# EAGLE schematic Clock (EAGLE 9.0.1)
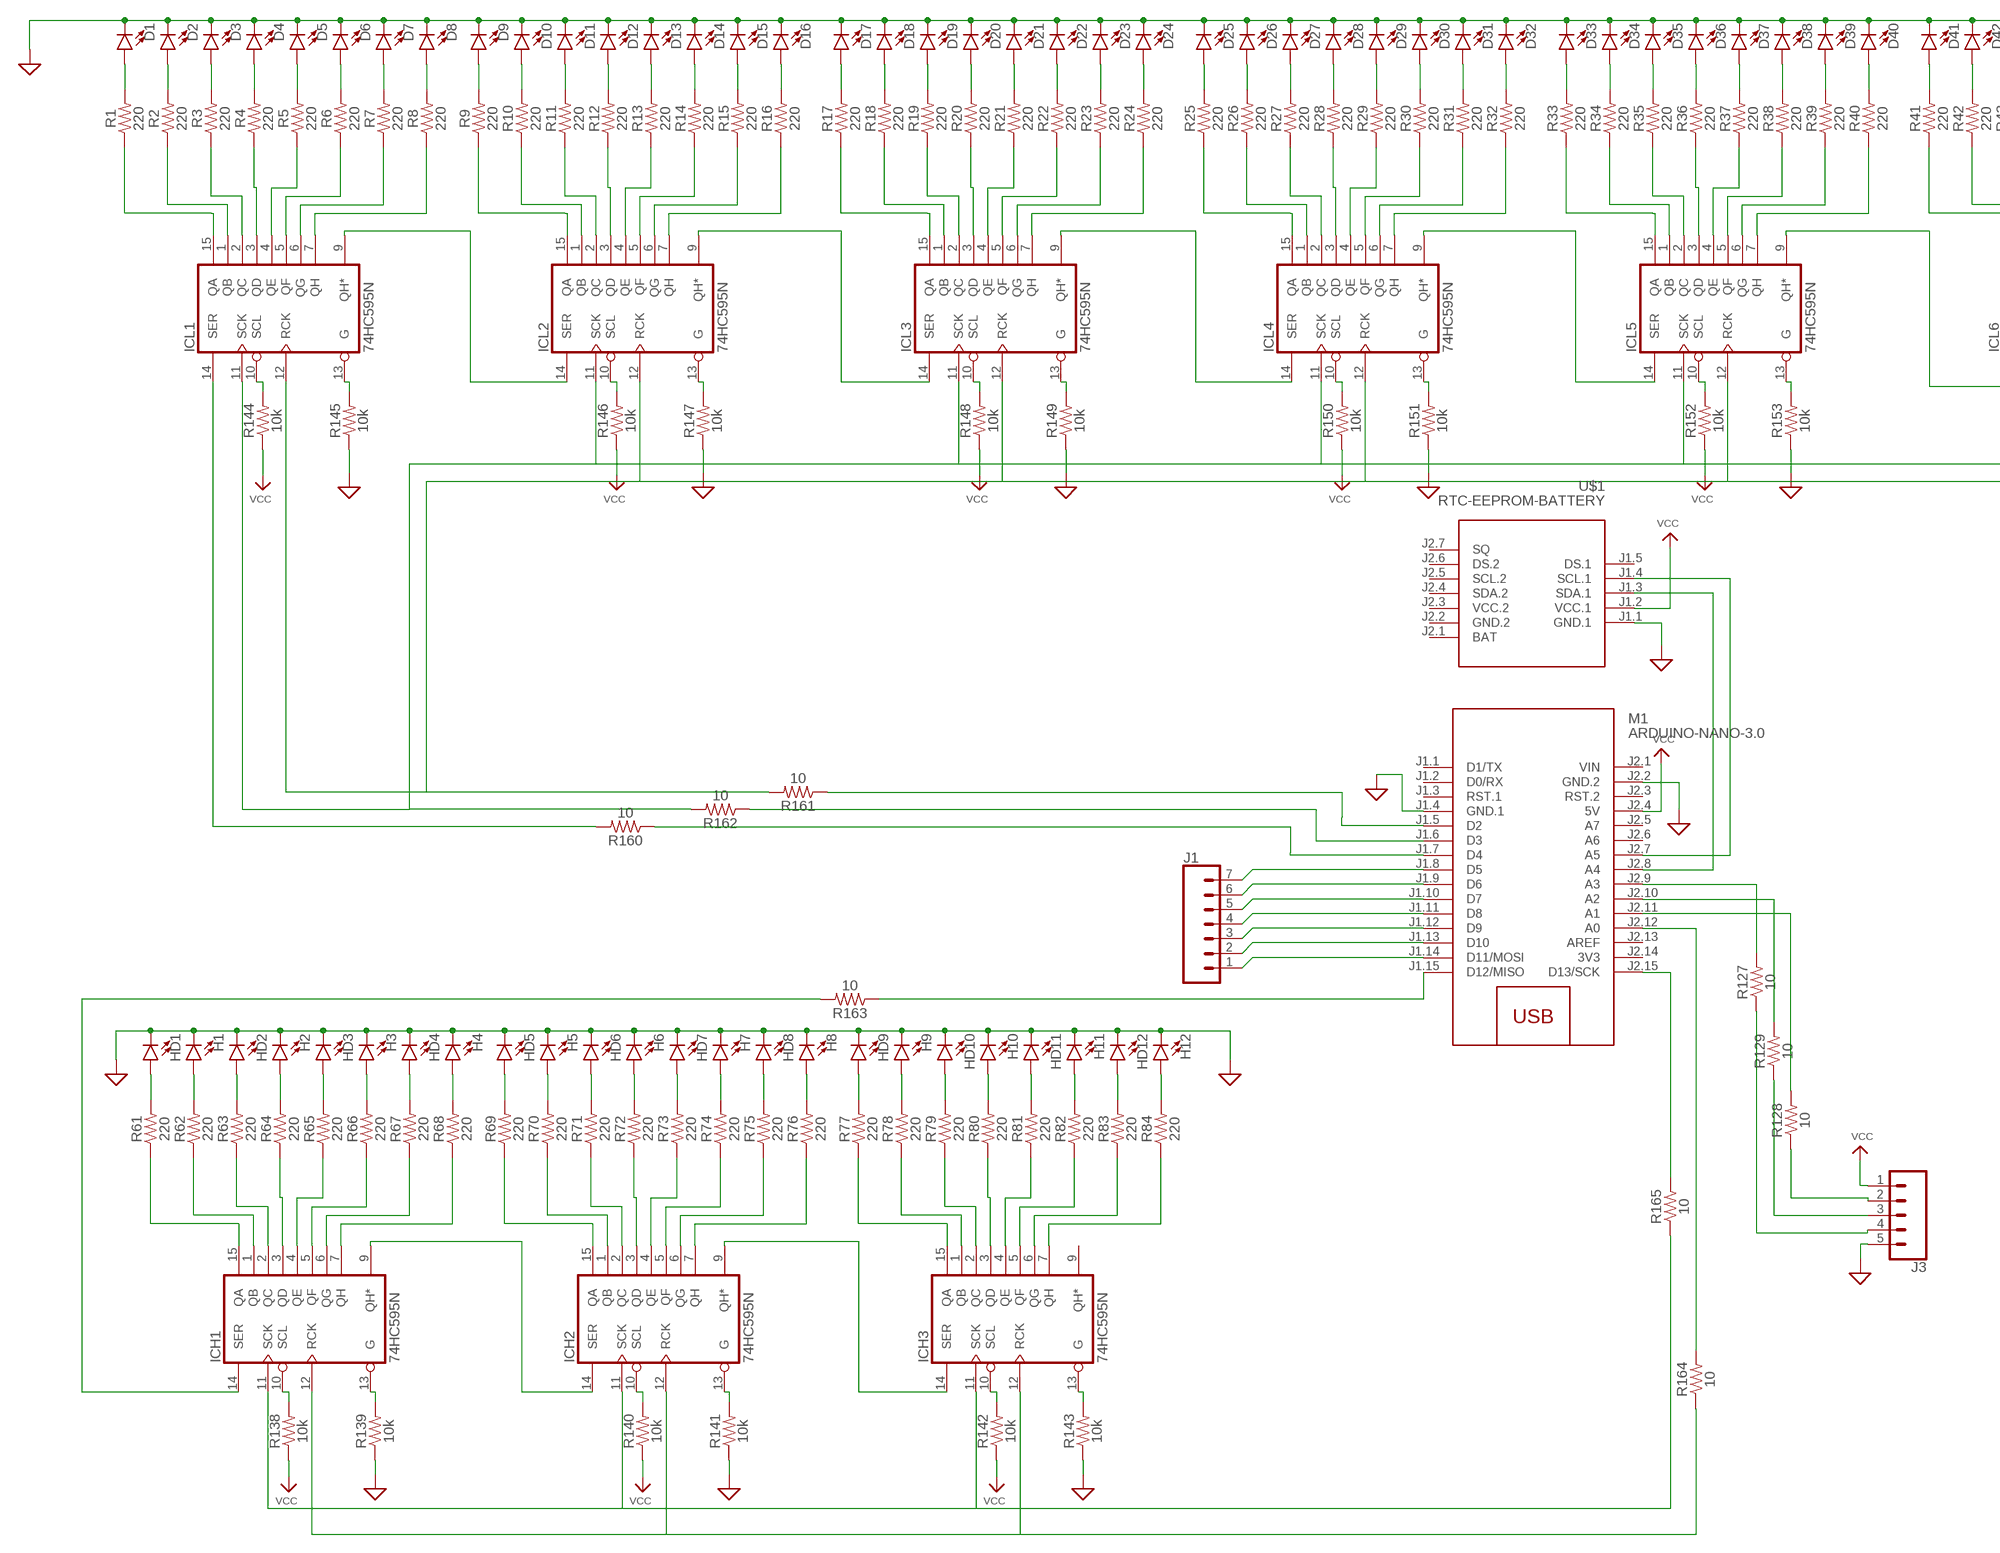
[diagram p0: schematic, sheet 1, part 1 of 2]
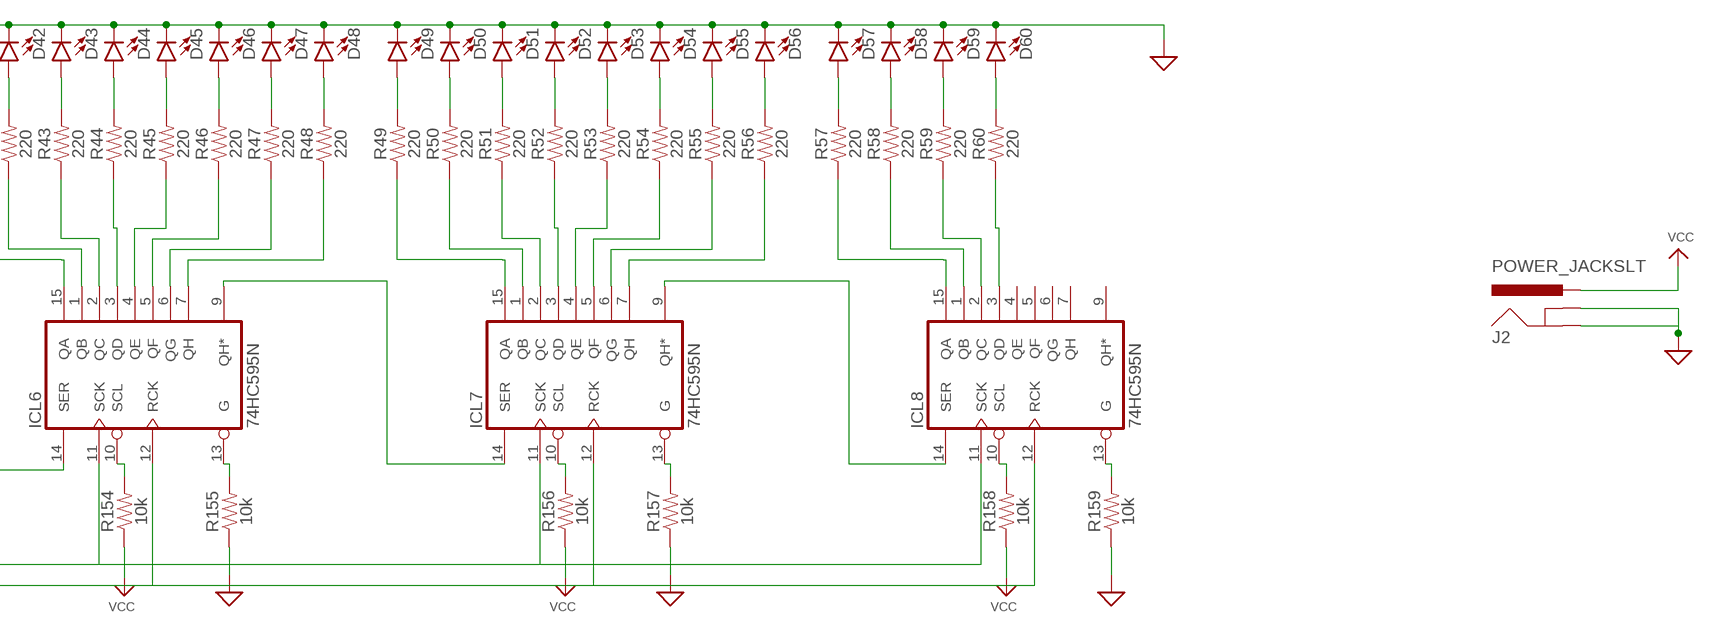
[diagram p1: schematic, sheet 1, part 2 of 2]

## Parts
D1  LED5MM  [LED_5MM]
D2  LED5MM  [LED_5MM]
D3  LED5MM  [LED_5MM]
D4  LED5MM  [LED_5MM]
D5  LED5MM  [LED_5MM]
D6  LED5MM  [LED_5MM]
D7  LED5MM  [LED_5MM]
D8  LED5MM  [LED_5MM]
D9  LED5MM  [LED_5MM]
D10  LED5MM  [LED_5MM]
D11  LED5MM  [LED_5MM]
D12  LED5MM  [LED_5MM]
D13  LED5MM  [LED_5MM]
D14  LED5MM  [LED_5MM]
D15  LED5MM  [LED_5MM]
D16  LED5MM  [LED_5MM]
D17  LED5MM  [LED_5MM]
D18  LED5MM  [LED_5MM]
D19  LED5MM  [LED_5MM]
D20  LED5MM  [LED_5MM]
D21  LED5MM  [LED_5MM]
D22  LED5MM  [LED_5MM]
D23  LED5MM  [LED_5MM]
D24  LED5MM  [LED_5MM]
D25  LED5MM  [LED_5MM]
D26  LED5MM  [LED_5MM]
D27  LED5MM  [LED_5MM]
D28  LED5MM  [LED_5MM]
D29  LED5MM  [LED_5MM]
D30  LED5MM  [LED_5MM]
D31  LED5MM  [LED_5MM]
D32  LED5MM  [LED_5MM]
D33  LED5MM  [LED_5MM]
D34  LED5MM  [LED_5MM]
D35  LED5MM  [LED_5MM]
D36  LED5MM  [LED_5MM]
D37  LED5MM  [LED_5MM]
D38  LED5MM  [LED_5MM]
D39  LED5MM  [LED_5MM]
D40  LED5MM  [LED_5MM]
D41  LED5MM  [LED_5MM]
D42  LED5MM  [LED_5MM]
D43  LED5MM  [LED_5MM]
D44  LED5MM  [LED_5MM]
D45  LED5MM  [LED_5MM]
D46  LED5MM  [LED_5MM]
D47  LED5MM  [LED_5MM]
D48  LED5MM  [LED_5MM]
D49  LED5MM  [LED_5MM]
D50  LED5MM  [LED_5MM]
D51  LED5MM  [LED_5MM]
D52  LED5MM  [LED_5MM]
D53  LED5MM  [LED_5MM]
D54  LED5MM  [LED_5MM]
D55  LED5MM  [LED_5MM]
D56  LED5MM  [LED_5MM]
D57  LED5MM  [LED_5MM]
D58  LED5MM  [LED_5MM]
D59  LED5MM  [LED_5MM]
D60  LED5MM  [LED_5MM]
H1  LED5MM  [LED_5MM]
H2  LED5MM  [LED_5MM]
H3  LED5MM  [LED_5MM]
H4  LED5MM  [LED_5MM]
H5  LED5MM  [LED_5MM]
H6  LED5MM  [LED_5MM]
H7  LED5MM  [LED_5MM]
H8  LED5MM  [LED_5MM]
H9  LED5MM  [LED_5MM]
H10  LED5MM  [LED_5MM]
H11  LED5MM  [LED_5MM]
H12  LED5MM  [LED_5MM]
HD1  LED5MM  [LED_5MM]
HD2  LED5MM  [LED_5MM]
HD3  LED5MM  [LED_5MM]
HD4  LED5MM  [LED_5MM]
HD5  LED5MM  [LED_5MM]
HD6  LED5MM  [LED_5MM]
HD7  LED5MM  [LED_5MM]
HD8  LED5MM  [LED_5MM]
HD9  LED5MM  [LED_5MM]
HD10  LED5MM  [LED_5MM]
HD11  LED5MM  [LED_5MM]
HD12  LED5MM  [LED_5MM]
ICH1  74HC595N  [DIL16]
ICH2  74HC595N  [DIL16]
ICH3  74HC595N  [DIL16]
ICL1  74HC595N  [DIL16]
ICL2  74HC595N  [DIL16]
ICL3  74HC595N  [DIL16]
ICL4  74HC595N  [DIL16]
ICL5  74HC595N  [DIL16]
ICL6  74HC595N  [DIL16]
ICL7  74HC595N  [DIL16]
ICL8  74HC595N  [DIL16]
J1  CONN_07LOCK_LONGPADS  [1X07_LOCK_LONGPADS]
J2  POWER_JACKSLT  [POWER_JACK_SLOT]
J3  CONN_05LOCK_LONGPADS  [1X05_LOCK_LONGPADS]
M1  ARDUINO-NANO-3.0  [ARDUINO-NANO-3.0]
R1  220  1KOHM-HORIZ-1/4W-1%  [AXIAL-0.3]
R2  220  1KOHM-HORIZ-1/4W-1%  [AXIAL-0.3]
R3  220  1KOHM-HORIZ-1/4W-1%  [AXIAL-0.3]
R4  220  1KOHM-HORIZ-1/4W-1%  [AXIAL-0.3]
R5  220  1KOHM-HORIZ-1/4W-1%  [AXIAL-0.3]
R6  220  1KOHM-HORIZ-1/4W-1%  [AXIAL-0.3]
R7  220  1KOHM-HORIZ-1/4W-1%  [AXIAL-0.3]
R8  220  1KOHM-HORIZ-1/4W-1%  [AXIAL-0.3]
R9  220  1KOHM-HORIZ-1/4W-1%  [AXIAL-0.3]
R10  220  1KOHM-HORIZ-1/4W-1%  [AXIAL-0.3]
R11  220  1KOHM-HORIZ-1/4W-1%  [AXIAL-0.3]
R12  220  1KOHM-HORIZ-1/4W-1%  [AXIAL-0.3]
R13  220  1KOHM-HORIZ-1/4W-1%  [AXIAL-0.3]
R14  220  1KOHM-HORIZ-1/4W-1%  [AXIAL-0.3]
R15  220  1KOHM-HORIZ-1/4W-1%  [AXIAL-0.3]
R16  220  1KOHM-HORIZ-1/4W-1%  [AXIAL-0.3]
R17  220  1KOHM-HORIZ-1/4W-1%  [AXIAL-0.3]
R18  220  1KOHM-HORIZ-1/4W-1%  [AXIAL-0.3]
R19  220  1KOHM-HORIZ-1/4W-1%  [AXIAL-0.3]
R20  220  1KOHM-HORIZ-1/4W-1%  [AXIAL-0.3]
R21  220  1KOHM-HORIZ-1/4W-1%  [AXIAL-0.3]
R22  220  1KOHM-HORIZ-1/4W-1%  [AXIAL-0.3]
R23  220  1KOHM-HORIZ-1/4W-1%  [AXIAL-0.3]
R24  220  1KOHM-HORIZ-1/4W-1%  [AXIAL-0.3]
R25  220  1KOHM-HORIZ-1/4W-1%  [AXIAL-0.3]
R26  220  1KOHM-HORIZ-1/4W-1%  [AXIAL-0.3]
R27  220  1KOHM-HORIZ-1/4W-1%  [AXIAL-0.3]
R28  220  1KOHM-HORIZ-1/4W-1%  [AXIAL-0.3]
R29  220  1KOHM-HORIZ-1/4W-1%  [AXIAL-0.3]
R30  220  1KOHM-HORIZ-1/4W-1%  [AXIAL-0.3]
R31  220  1KOHM-HORIZ-1/4W-1%  [AXIAL-0.3]
R32  220  1KOHM-HORIZ-1/4W-1%  [AXIAL-0.3]
R33  220  1KOHM-HORIZ-1/4W-1%  [AXIAL-0.3]
R34  220  1KOHM-HORIZ-1/4W-1%  [AXIAL-0.3]
R35  220  1KOHM-HORIZ-1/4W-1%  [AXIAL-0.3]
R36  220  1KOHM-HORIZ-1/4W-1%  [AXIAL-0.3]
R37  220  1KOHM-HORIZ-1/4W-1%  [AXIAL-0.3]
R38  220  1KOHM-HORIZ-1/4W-1%  [AXIAL-0.3]
R39  220  1KOHM-HORIZ-1/4W-1%  [AXIAL-0.3]
R40  220  1KOHM-HORIZ-1/4W-1%  [AXIAL-0.3]
R41  220  1KOHM-HORIZ-1/4W-1%  [AXIAL-0.3]
R42  220  1KOHM-HORIZ-1/4W-1%  [AXIAL-0.3]
R43  220  1KOHM-HORIZ-1/4W-1%  [AXIAL-0.3]
R44  220  1KOHM-HORIZ-1/4W-1%  [AXIAL-0.3]
R45  220  1KOHM-HORIZ-1/4W-1%  [AXIAL-0.3]
R46  220  1KOHM-HORIZ-1/4W-1%  [AXIAL-0.3]
R47  220  1KOHM-HORIZ-1/4W-1%  [AXIAL-0.3]
R48  220  1KOHM-HORIZ-1/4W-1%  [AXIAL-0.3]
R49  220  1KOHM-HORIZ-1/4W-1%  [AXIAL-0.3]
R50  220  1KOHM-HORIZ-1/4W-1%  [AXIAL-0.3]
R51  220  1KOHM-HORIZ-1/4W-1%  [AXIAL-0.3]
R52  220  1KOHM-HORIZ-1/4W-1%  [AXIAL-0.3]
R53  220  1KOHM-HORIZ-1/4W-1%  [AXIAL-0.3]
R54  220  1KOHM-HORIZ-1/4W-1%  [AXIAL-0.3]
R55  220  1KOHM-HORIZ-1/4W-1%  [AXIAL-0.3]
R56  220  1KOHM-HORIZ-1/4W-1%  [AXIAL-0.3]
R57  220  1KOHM-HORIZ-1/4W-1%  [AXIAL-0.3]
R58  220  1KOHM-HORIZ-1/4W-1%  [AXIAL-0.3]
R59  220  1KOHM-HORIZ-1/4W-1%  [AXIAL-0.3]
R60  220  1KOHM-HORIZ-1/4W-1%  [AXIAL-0.3]
R61  220  1KOHM-HORIZ-1/4W-1%  [AXIAL-0.3]
R62  220  1KOHM-HORIZ-1/4W-1%  [AXIAL-0.3]
R63  220  1KOHM-HORIZ-1/4W-1%  [AXIAL-0.3]
R64  220  1KOHM-HORIZ-1/4W-1%  [AXIAL-0.3]
R65  220  1KOHM-HORIZ-1/4W-1%  [AXIAL-0.3]
R66  220  1KOHM-HORIZ-1/4W-1%  [AXIAL-0.3]
R67  220  1KOHM-HORIZ-1/4W-1%  [AXIAL-0.3]
R68  220  1KOHM-HORIZ-1/4W-1%  [AXIAL-0.3]
R69  220  1KOHM-HORIZ-1/4W-1%  [AXIAL-0.3]
R70  220  1KOHM-HORIZ-1/4W-1%  [AXIAL-0.3]
R71  220  1KOHM-HORIZ-1/4W-1%  [AXIAL-0.3]
R72  220  1KOHM-HORIZ-1/4W-1%  [AXIAL-0.3]
R73  220  1KOHM-HORIZ-1/4W-1%  [AXIAL-0.3]
R74  220  1KOHM-HORIZ-1/4W-1%  [AXIAL-0.3]
R75  220  1KOHM-HORIZ-1/4W-1%  [AXIAL-0.3]
R76  220  1KOHM-HORIZ-1/4W-1%  [AXIAL-0.3]
R77  220  1KOHM-HORIZ-1/4W-1%  [AXIAL-0.3]
R78  220  1KOHM-HORIZ-1/4W-1%  [AXIAL-0.3]
R79  220  1KOHM-HORIZ-1/4W-1%  [AXIAL-0.3]
R80  220  1KOHM-HORIZ-1/4W-1%  [AXIAL-0.3]
R81  220  1KOHM-HORIZ-1/4W-1%  [AXIAL-0.3]
R82  220  1KOHM-HORIZ-1/4W-1%  [AXIAL-0.3]
R83  220  1KOHM-HORIZ-1/4W-1%  [AXIAL-0.3]
R84  220  1KOHM-HORIZ-1/4W-1%  [AXIAL-0.3]
R127  10  10OHM-HORIZ-1/4W-1%  [AXIAL-0.3]
R128  10  10OHM-HORIZ-1/4W-1%  [AXIAL-0.3]
R129  10  10OHM-HORIZ-1/4W-1%  [AXIAL-0.3]
R138  10k  10KOHM-HORIZ-1/6W-5%  [AXIAL-0.3]
R139  10k  10KOHM-HORIZ-1/6W-5%  [AXIAL-0.3]
R140  10k  10KOHM-HORIZ-1/6W-5%  [AXIAL-0.3]
R141  10k  10KOHM-HORIZ-1/6W-5%  [AXIAL-0.3]
R142  10k  10KOHM-HORIZ-1/6W-5%  [AXIAL-0.3]
R143  10k  10KOHM-HORIZ-1/6W-5%  [AXIAL-0.3]
R144  10k  10KOHM-HORIZ-1/6W-5%  [AXIAL-0.3]
R145  10k  10KOHM-HORIZ-1/6W-5%  [AXIAL-0.3]
R146  10k  10KOHM-HORIZ-1/6W-5%  [AXIAL-0.3]
R147  10k  10KOHM-HORIZ-1/6W-5%  [AXIAL-0.3]
R148  10k  10KOHM-HORIZ-1/6W-5%  [AXIAL-0.3]
R149  10k  10KOHM-HORIZ-1/6W-5%  [AXIAL-0.3]
R150  10k  10KOHM-HORIZ-1/6W-5%  [AXIAL-0.3]
R151  10k  10KOHM-HORIZ-1/6W-5%  [AXIAL-0.3]
R152  10k  10KOHM-HORIZ-1/6W-5%  [AXIAL-0.3]
R153  10k  10KOHM-HORIZ-1/6W-5%  [AXIAL-0.3]
R154  10k  10KOHM-HORIZ-1/6W-5%  [AXIAL-0.3]
R155  10k  10KOHM-HORIZ-1/6W-5%  [AXIAL-0.3]
R156  10k  10KOHM-HORIZ-1/6W-5%  [AXIAL-0.3]
R157  10k  10KOHM-HORIZ-1/6W-5%  [AXIAL-0.3]
R158  10k  10KOHM-HORIZ-1/6W-5%  [AXIAL-0.3]
R159  10k  10KOHM-HORIZ-1/6W-5%  [AXIAL-0.3]
R160  10  10OHM-HORIZ-1/4W-1%  [AXIAL-0.3]
R161  10  10OHM-HORIZ-1/4W-1%  [AXIAL-0.3]
R162  10  10OHM-HORIZ-1/4W-1%  [AXIAL-0.3]
R163  10  10OHM-HORIZ-1/4W-1%  [AXIAL-0.3]
R164  10  10OHM-HORIZ-1/4W-1%  [AXIAL-0.3]
R165  10  10OHM-HORIZ-1/4W-1%  [AXIAL-0.3]
U$1  RTC-EEPROM-BATTERY  [RTC-EEPROM-BATTERY]

## Nets
GND: D1.K(C) D2.K(C) D3.K(C) D4.K(C) D5.K(C) D6.K(C) D7.K(C) D8.K(C) D9.K(C) D10.K(C) D11.K(C) D12.K(C) D13.K(C) D14.K(C) D15.K(C) D16.K(C) D17.K(C) D18.K(C) D19.K(C) D20.K(C) D21.K(C) D22.K(C) D23.K(C) D24.K(C) D25.K(C) D26.K(C) D27.K(C) D28.K(C) D29.K(C) D30.K(C) D31.K(C) D32.K(C) D33.K(C) D34.K(C) D35.K(C) D36.K(C) D37.K(C) D38.K(C) D39.K(C) D40.K(C) D41.K(C) D42.K(C) D43.K(C) D44.K(C) D45.K(C) D46.K(C) D47.K(C) D48.K(C) D49.K(C) D50.K(C) D51.K(C) D52.K(C) D53.K(C) D54.K(C) D55.K(C) D56.K(C) D57.K(C) D58.K(C) D59.K(C) D60.K(C) H1.K(C) H2.K(C) H3.K(C) H4.K(C) H5.K(C) H6.K(C) H7.K(C) H8.K(C) H9.K(C) H10.K(C) H11.K(C) H12.K(C) HD1.K(C) HD2.K(C) HD3.K(C) HD4.K(C) HD5.K(C) HD6.K(C) HD7.K(C) HD8.K(C) HD9.K(C) HD10.K(C) HD11.K(C) HD12.K(C) J2.GND@1(GNDBREAK) J2.GND@2(GND) J3.5 M1.J1.4(GND.1) M1.J2.2(GND.2) R139.P$1 R141.P$1 R143.P$1 R145.P$1 R147.P$1 R149.P$1 R151.P$1 R153.P$1 R155.P$1 R157.P$1 R159.P$1 U$1.J1.1(GND.1) ; supply symbol labelled SUP
N$48: M1.J2.7(A5) U$1.J1.4(SCL.1)
N$49: M1.J2.8(A4) U$1.J1.3(SDA.1)
N$50: J1.7 M1.J1.8(D5)
N$51: J1.6 M1.J1.9(D6)
N$52: J1.5 M1.J1.10(D7)
N$53: J1.4 M1.J1.11(D8)
N$54: J1.3 M1.J1.12(D9)
N$55: J1.2 M1.J1.13(D10)
N$56: J1.1 M1.J1.14(D11/MOSI)
N$57: ICL1.5(QF) R6.P$1
N$58: ICL1.7(QH) R8.P$1
N$59: ICL1.3(QD) R4.P$1
N$60: ICL1.4(QE) R5.P$1
N$61: ICL1.2(QC) R3.P$1
N$62: ICL1.1(QB) R2.P$1
N$63: ICL1.6(QG) R7.P$1
N$64: ICH1.6(QG) R67.P$1
N$65: D1.A R1.P$2
N$66: D2.A R2.P$2
N$67: D3.A R3.P$2
N$68: D4.A R4.P$2
N$69: D5.A R5.P$2
N$70: D6.A R6.P$2
N$71: D7.A R7.P$2
N$72: D8.A R8.P$2
N$73: ICL1.15(QA) R1.P$1
N$74: ICL2.6(QG) R15.P$1
N$75: D9.A R9.P$2
N$76: D10.A R10.P$2
N$77: D11.A R11.P$2
N$78: D12.A R12.P$2
N$79: D13.A R13.P$2
N$80: D14.A R14.P$2
N$81: D15.A R15.P$2
N$82: D16.A R16.P$2
N$83: ICL2.7(QH) R16.P$1
N$84: ICL2.15(QA) R9.P$1
N$85: ICL2.5(QF) R14.P$1
N$86: ICL2.2(QC) R11.P$1
N$87: ICL2.1(QB) R10.P$1
N$88: ICL2.3(QD) R12.P$1
N$89: ICL2.4(QE) R13.P$1
N$90: ICL1.14(SER) R160.P$2
N$91: ICL3.6(QG) R23.P$1
N$92: D17.A R17.P$2
N$93: D18.A R18.P$2
N$94: D19.A R19.P$2
N$95: D20.A R20.P$2
N$96: D21.A R21.P$2
N$97: D22.A R22.P$2
N$98: D23.A R23.P$2
N$99: D24.A R24.P$2
N$100: ICL3.7(QH) R24.P$1
N$101: ICL3.15(QA) R17.P$1
N$102: ICL3.5(QF) R22.P$1
N$103: ICL3.2(QC) R19.P$1
N$104: ICL3.1(QB) R18.P$1
N$105: ICL3.3(QD) R20.P$1
N$106: ICL3.4(QE) R21.P$1
N$107: HD1.A R61.P$2
N$108: ICL4.6(QG) R31.P$1
N$109: D25.A R25.P$2
N$110: D26.A R26.P$2
N$111: D27.A R27.P$2
N$112: D28.A R28.P$2
N$113: D29.A R29.P$2
N$114: D30.A R30.P$2
N$115: D31.A R31.P$2
N$116: D32.A R32.P$2
N$117: ICL4.7(QH) R32.P$1
N$118: ICL4.15(QA) R25.P$1
N$119: ICL4.5(QF) R30.P$1
N$120: ICL4.2(QC) R27.P$1
N$121: ICL4.1(QB) R26.P$1
N$122: ICL4.3(QD) R28.P$1
N$123: ICL4.4(QE) R29.P$1
N$124: ICL1.12(RCK) ICL2.12(RCK) ICL3.12(RCK) ICL4.12(RCK) ICL5.12(RCK) ICL6.12(RCK) ICL7.12(RCK) ICL8.12(RCK) R161.P$2
N$125: ICL5.6(QG) R39.P$1
N$126: D33.A R33.P$2
N$127: D34.A R34.P$2
N$128: D35.A R35.P$2
N$129: D36.A R36.P$2
N$130: D37.A R37.P$2
N$131: D38.A R38.P$2
N$132: D39.A R39.P$2
N$133: D40.A R40.P$2
N$134: ICL5.7(QH) R40.P$1
N$135: ICL5.15(QA) R33.P$1
N$136: ICL5.5(QF) R38.P$1
N$137: ICL5.2(QC) R35.P$1
N$138: ICL5.1(QB) R34.P$1
N$139: ICL5.3(QD) R36.P$1
N$140: ICL5.4(QE) R37.P$1
N$141: ICL1.9(QH*) ICL2.14(SER)
N$142: ICL6.6(QG) R47.P$1
N$143: D41.A R41.P$2
N$144: D42.A R42.P$2
N$145: D43.A R43.P$2
N$146: D44.A R44.P$2
N$147: D45.A R45.P$2
N$148: D46.A R46.P$2
N$149: D47.A R47.P$2
N$150: D48.A R48.P$2
N$151: ICL6.7(QH) R48.P$1
N$152: ICL6.15(QA) R41.P$1
N$153: ICL6.5(QF) R46.P$1
N$154: ICL6.2(QC) R43.P$1
N$155: ICL6.1(QB) R42.P$1
N$156: ICL6.3(QD) R44.P$1
N$157: ICL6.4(QE) R45.P$1
N$158: ICL2.9(QH*) ICL3.14(SER)
N$159: ICL7.6(QG) R55.P$1
N$160: D49.A R49.P$2
N$161: D50.A R50.P$2
N$162: D51.A R51.P$2
N$163: D52.A R52.P$2
N$164: D53.A R53.P$2
N$165: D54.A R54.P$2
N$166: D55.A R55.P$2
N$167: D56.A R56.P$2
N$168: ICL7.7(QH) R56.P$1
N$169: ICL7.15(QA) R49.P$1
N$170: ICL7.5(QF) R54.P$1
N$171: ICL7.2(QC) R51.P$1
N$172: ICL7.1(QB) R50.P$1
N$173: ICL7.3(QD) R52.P$1
N$174: ICL7.4(QE) R53.P$1
N$175: ICL3.9(QH*) ICL4.14(SER)
N$176: ICL4.9(QH*) ICL5.14(SER)
N$177: D57.A R57.P$2
N$178: D58.A R58.P$2
N$179: D59.A R59.P$2
N$180: D60.A R60.P$2
N$181: ICL5.9(QH*) ICL6.14(SER)
N$182: ICL6.9(QH*) ICL7.14(SER)
N$183: ICL7.9(QH*) ICL8.14(SER)
N$184: ICL1.11(SCK) ICL2.11(SCK) ICL3.11(SCK) ICL4.11(SCK) ICL5.11(SCK) ICL6.11(SCK) ICL7.11(SCK) ICL8.11(SCK) R162.P$2
N$185: H1.A R62.P$2
N$186: ICL8.15(QA) R57.P$1
N$187: HD2.A R63.P$2
N$188: ICL8.2(QC) R59.P$1
N$189: ICL8.1(QB) R58.P$1
N$190: ICL8.3(QD) R60.P$1
N$191: H2.A R64.P$2
N$192: HD3.A R65.P$2
N$193: H3.A R66.P$2
N$194: HD4.A R67.P$2
N$195: H4.A R68.P$2
N$196: ICH1.7(QH) R68.P$1
N$197: ICH1.15(QA) R61.P$1
N$198: ICH1.5(QF) R66.P$1
N$199: ICH1.2(QC) R63.P$1
N$200: ICH1.1(QB) R62.P$1
N$201: ICH1.3(QD) R64.P$1
N$202: ICH1.4(QE) R65.P$1
N$203: ICH2.6(QG) R75.P$1
N$204: HD5.A R69.P$2
N$205: H5.A R70.P$2
N$206: HD6.A R71.P$2
N$207: H6.A R72.P$2
N$208: HD7.A R73.P$2
N$209: H7.A R74.P$2
N$210: HD8.A R75.P$2
N$211: H8.A R76.P$2
N$212: ICH2.7(QH) R76.P$1
N$213: ICH2.15(QA) R69.P$1
N$214: ICH2.5(QF) R74.P$1
N$215: ICH2.2(QC) R71.P$1
N$216: ICH2.1(QB) R70.P$1
N$217: ICH2.3(QD) R72.P$1
N$218: ICH2.4(QE) R73.P$1
N$219: ICH3.6(QG) R83.P$1
N$220: HD9.A R77.P$2
N$221: H9.A R78.P$2
N$222: HD10.A R79.P$2
N$223: H10.A R80.P$2
N$224: HD11.A R81.P$2
N$225: H11.A R82.P$2
N$226: HD12.A R83.P$2
N$227: H12.A R84.P$2
N$228: ICH3.7(QH) R84.P$1
N$229: ICH3.15(QA) R77.P$1
N$230: ICH3.5(QF) R82.P$1
N$231: ICH3.2(QC) R79.P$1
N$232: ICH3.1(QB) R78.P$1
N$233: ICH3.3(QD) R80.P$1
N$234: ICH3.4(QE) R81.P$1
N$235: ICH1.14(SER) R163.P$2
N$236: ICH1.11(SCK) ICH2.11(SCK) ICH3.11(SCK) R165.P$1
N$237: ICH1.12(RCK) ICH2.12(RCK) ICH3.12(RCK) R164.P$1
N$238: ICH1.9(QH*) ICH2.14(SER)
N$239: ICH2.9(QH*) ICH3.14(SER)
N$250: M1.J2.9(A3) R127.P$2
N$290: ICH1.10(SCL) R138.P$2
N$291: ICH1.13(G) R139.P$2
N$292: ICH2.10(SCL) R140.P$2
N$293: ICH2.13(G) R141.P$2
N$294: ICH3.10(SCL) R142.P$2
N$295: ICH3.13(G) R143.P$2
N$296: ICL1.10(SCL) R144.P$2
N$297: ICL1.13(G) R145.P$2
N$298: ICL2.10(SCL) R146.P$2
N$299: ICL2.13(G) R147.P$2
N$300: ICL3.10(SCL) R148.P$2
N$301: ICL3.13(G) R149.P$2
N$302: ICL4.10(SCL) R150.P$2
N$303: ICL4.13(G) R151.P$2
N$304: ICL5.10(SCL) R152.P$2
N$305: ICL5.13(G) R153.P$2
N$306: ICL6.10(SCL) R154.P$2
N$307: ICL6.13(G) R155.P$2
N$308: ICL7.10(SCL) R156.P$2
N$309: ICL7.13(G) R157.P$2
N$310: ICL8.10(SCL) R158.P$2
N$311: ICL8.13(G) R159.P$2
N$312: M1.J1.15(D12/MISO) R163.P$1
N$313: M1.J2.10(A2) R129.P$2
N$314: M1.J2.11(A1) R128.P$2
N$316: M1.J2.15(D13/SCK) R165.P$2
N$317: M1.J2.12(A0) R164.P$2
N$318: M1.J1.7(D4) R160.P$1
N$319: M1.J1.6(D3) R162.P$1
N$320: M1.J1.5(D2) R161.P$1
N$336: J3.4 R127.P$1
N$337: J3.2 R128.P$1
N$338: J3.3 R129.P$1
VCC: J2.PWR J3.1 M1.J2.4(5V) R138.P$1 R140.P$1 R142.P$1 R144.P$1 R146.P$1 R148.P$1 R150.P$1 R152.P$1 R154.P$1 R156.P$1 R158.P$1 U$1.J1.2(VCC.1)
Unconnected: ICH3.9(QH*) ICL8.4(QE) ICL8.5(QF) ICL8.6(QG) ICL8.7(QH) ICL8.9(QH*) M1.J1.1(D1/TX) M1.J1.2(D0/RX) M1.J1.3(RST.1) M1.J2.3(RST.2) M1.J2.5(A7) M1.J2.6(A6) M1.J2.13(AREF) U$1.J1.5(DS.1) U$1.J2.1(BAT) U$1.J2.4(SDA.2) U$1.J2.5(SCL.2) U$1.J2.6(DS.2) U$1.J2.7(SQ)

## Power pins joined to a net without a drawn wire
3V3: M1.J2.14(3V3)
GND: ICH1.8(GND) ICH2.8(GND) ICH3.8(GND) ICL1.8(GND) ICL2.8(GND) ICL3.8(GND) ICL4.8(GND) ICL5.8(GND) ICL6.8(GND) ICL7.8(GND) ICL8.8(GND)
GND.2: U$1.J2.2(GND.2)
VCC: ICH1.16(VCC) ICH2.16(VCC) ICH3.16(VCC) ICL1.16(VCC) ICL2.16(VCC) ICL3.16(VCC) ICL4.16(VCC) ICL5.16(VCC) ICL6.16(VCC) ICL7.16(VCC) ICL8.16(VCC)
VCC.2: U$1.J2.3(VCC.2)
VIN: M1.J2.1(VIN)

## Library data of the parts
D1-D60 H1-H12 HD1-HD12 = SparkFun-LED:LED: LED (Generic) Standard schematic elements and footprints for 5mm, 3mm, 1206, and 0603 sized LEDs. Generic LEDs with no color specified.
ICH1-ICH3 ICL1-ICL8 = 74xx:74*595: 8-bit SHIFT REGISTER, output latch
J1 = SparkFun-Connectors:CONN_07: Multi connection point. Often used as Generic Header-pin footprint for 0.1 inch spaced/style header connections On any of the 0.1 inch spaced packages, you can populate with these: Break Away Headers - Straight <https://www.sparkfun.com/products/116> (PRT-00116) Break Away Male Headers - Right Angle <https://www.sparkfun.com/products/553> (PRT-00553) Female Headers <https://www.sparkfun.com/products/115> (PRT-00115) Break Away Headers - Machine Pin <https://www.sparkfun.com/products/117> (PRT-00117) Break Away Female Headers - Swiss Machine Pin <https://www.sparkfun.com/products/743> (PRT-00743) For SCREWTERMINALS and SPRING TERMINALS visit here: Screw Terimnals on SparkFun.com <https://www.sparkfun.com/search/results?term=Screw+Terminals> (5mm/3.5mm/2.54mm spacing) This device is also useful as a general connection point to wire up your design to another part of your project. Our various solder wires solder well into these plated through hole pads. Hook-Up Wire - Assortment (Stranded, 22 AWG) <https://www.sparkfun.com/products/11375> (PRT-11375) Hook-Up Wire - Assortment (Solid Core, 22 AWG) <https://www.sparkfun.com/products/11367> (PRT-11367) View the entire wire category on our website here <https://www.sparkfun.com/categories/141> Special notes: Molex polarized connector foot print use with SKU : PRT-08231 with associated crimp pins and housings. 1MM SMD Version SKU: PRT-10208 NOTES ON THE VARIANTS LOCK and LOCK_LONGPADS... This footprint was designed to help hold the alignment of a through-hole component (i.e. 6-pin header) while soldering it into place. You may notice that each hole has been shifted either up or down by 0.005 of an inch from it's more standard position (which is a perfectly straight line). This slight alteration caused the pins (the squares in the middle) to touch the edges of the holes. Because they are alternating, it causes a "brace" to hold the component in place. 0.005 has proven to be the perfect amount of "off-center" position when using our standard breakaway headers. Although looks a little odd when you look at the bare footprint, once you have a header in there, the alteration is very hard to notice. Also,if you push a header all the way into place, it is covered up entirely on the bottom side.
J2 = SparkFun-Connectors:POWER_JACK: Power Jack Connector This is the standard 5.5mm barrel jack for power. The PTH is the most common, proven, reliable, footprint. The Slot footprint only works if the mill layer is transmitted to the PCB fab house so be warned. Here are the connectors we sell at SparkFun: DC Barrel Power Jack/Connector <https://www.sparkfun.com/products/119> (PRT-00119) DC Barrel Power Jack/Connector (SMD) <https://www.sparkfun.com/products/12748> (PRT-12748) DC Barrel Jack Adapter - Breadboard Compatible <https://www.sparkfun.com/products/10811> (PRT-10811) It is used on this SparkFun product (and many, many others): SparkFun RedBoard - Programmed with Arduino <https://www.sparkfun.com/products/12757> (DEV-12757) Also, if you need a mating power supply or connector, please check these out: Wall Adapter Power Supply - 9VDC 650mA <https://www.sparkfun.com/products/298> (TOL-00298) DC Barrel Jack Adapter - Male <https://www.sparkfun.com/products/10287> (PRT-10287); PROD_ID: PRT-00119
J3 = SparkFun-Connectors:CONN_05: Multi connection point. Often used as Generic Header-pin footprint for 0.1 inch spaced/style header connections On any of the 0.1 inch spaced packages, you can populate with these: Break Away Headers - Straight <https://www.sparkfun.com/products/116> (PRT-00116) Break Away Male Headers - Right Angle <https://www.sparkfun.com/products/553> (PRT-00553) Female Headers <https://www.sparkfun.com/products/115> (PRT-00115) Break Away Headers - Machine Pin <https://www.sparkfun.com/products/117> (PRT-00117) Break Away Female Headers - Swiss Machine Pin <https://www.sparkfun.com/products/743> (PRT-00743) For SCREWTERMINALS and SPRING TERMINALS visit here: Screw Terimnals on SparkFun.com <https://www.sparkfun.com/search/results?term=Screw+Terminals> (5mm/3.5mm/2.54mm spacing) This device is also useful as a general connection point to wire up your design to another part of your project. Our various solder wires solder well into these plated through hole pads. Hook-Up Wire - Assortment (Stranded, 22 AWG) <https://www.sparkfun.com/products/11375> (PRT-11375) Hook-Up Wire - Assortment (Solid Core, 22 AWG) <https://www.sparkfun.com/products/11367> (PRT-11367) View the entire wire category on our website here <https://www.sparkfun.com/categories/141> Special notes: Molex polarized connector foot print use with SKU : PRT-08231 with associated crimp pins and housings. 1MM SMD Version SKU: PRT-10208
M1 = diy-modules(1):ARDUINO-NANO-3.0: Arduino Nano 3.0 and compatible devices More details available here: https://www.arduino.cc/en/Main/ArduinoBoardNano Click here to find device on ebay.com <http://www.ebay.com/sch/arduino+nano>
R1-R84 = SparkFun-Resistors:1KOHM: 1kΩ resistor A resistor is a passive two-terminal electrical component that implements electrical resistance as a circuit element. Resistors act to reduce current flow, and, at the same time, act to lower voltage levels within circuits. - Wikipedia; PROD_ID: RES-12182; VALUE: 1k
R127-R129 R160-R165 = SparkFun-Resistors:10OHM: 10Ω resistor A resistor is a passive two-terminal electrical component that implements electrical resistance as a circuit element. Resistors act to reduce current flow, and, at the same time, act to lower voltage levels within circuits. - Wikipedia; PROD_ID: RES-12180
R138-R159 = SparkFun-Resistors:10KOHM: 10kΩ resistor A resistor is a passive two-terminal electrical component that implements electrical resistance as a circuit element. Resistors act to reduce current flow, and, at the same time, act to lower voltage levels within circuits. - Wikipedia; PROD_ID: RES-08375
U$1 = diy-modules(1):RTC-EEPROM-BATTERY: RTC Module with Battery and EEPROM based on DS1307 and AT24C32 chips More details available here: http://henrysbench.capnfatz.com/henrys-bench/arduino-sensors-and-input/arduino-tiny-rtc-d1307-tutorial/ Click here to find device on ebay.com <http://www.ebay.com/sch/tiny+rtc+arduino>